# EasyEDA schematic BroadNode.json
TITLE: BroadNodeBase; REV: 1.0; Date: 2020-12-08; Sheet: 1/1; Drawn By: 36062A; Company: theBroadCorp.
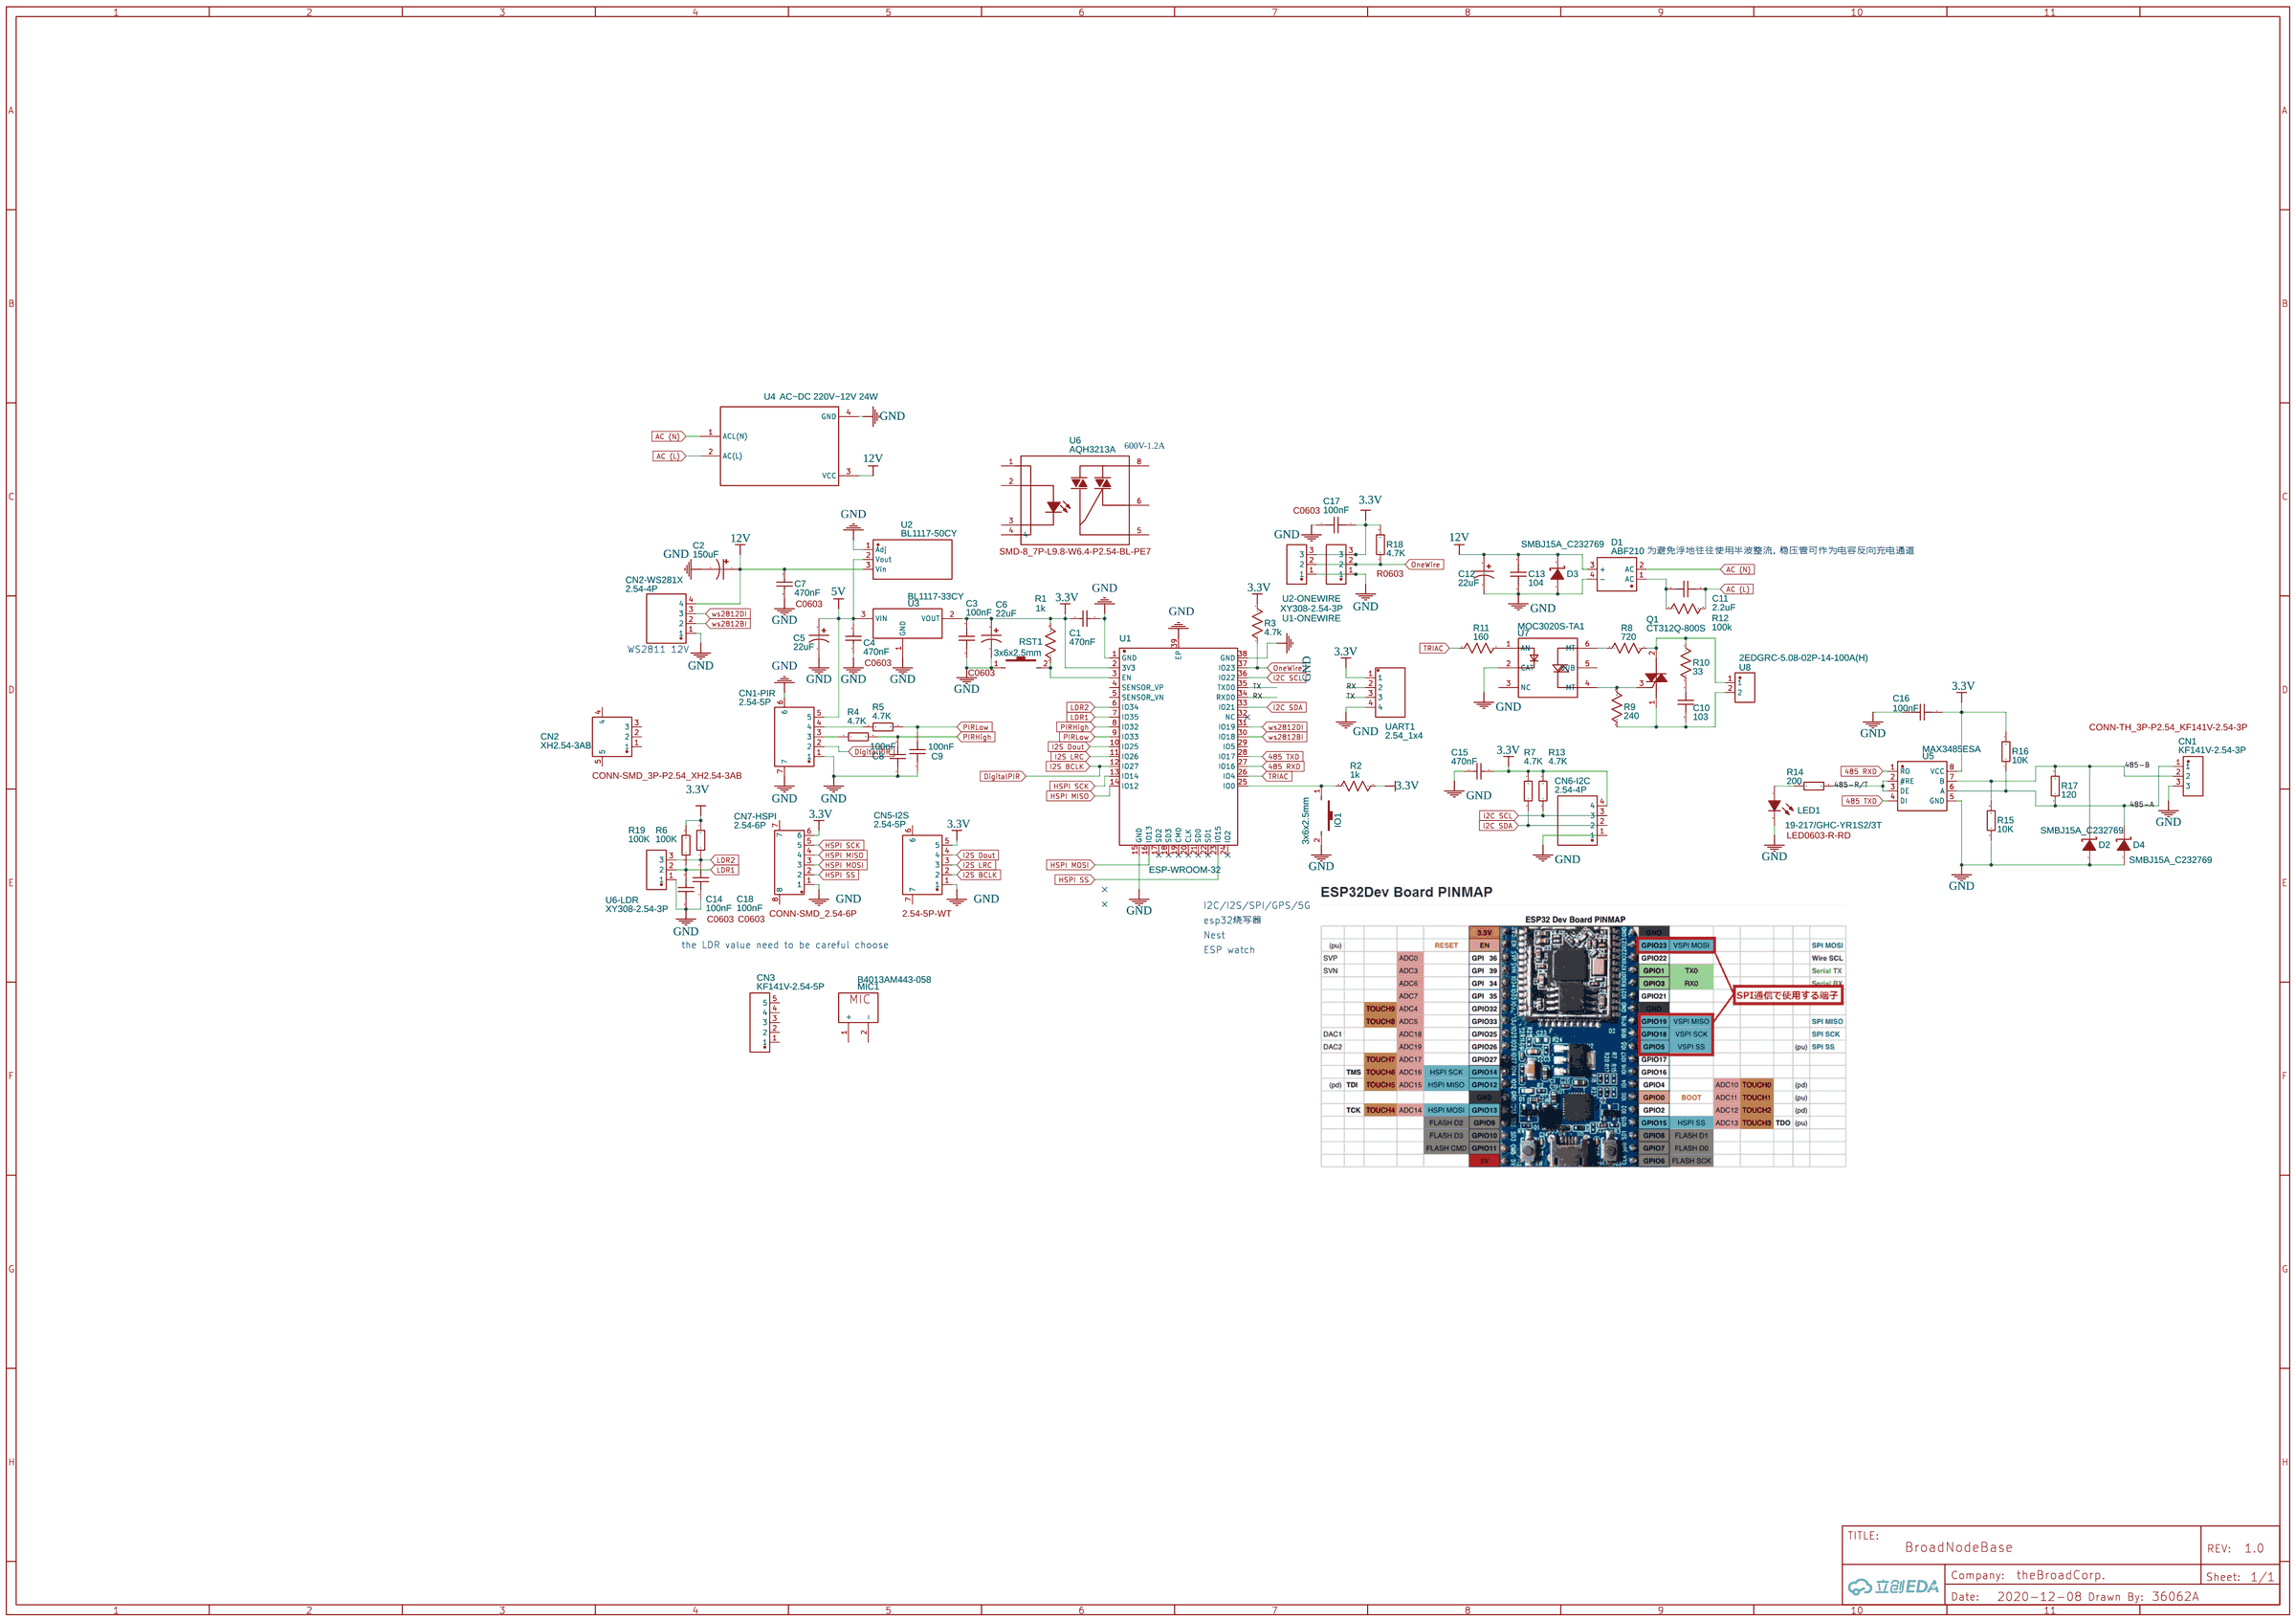
[diagram p0: schematic sheet]

## Parts
C1  470nF  [C0603]
C2  150uF  [CAP-SMD_BD8.0-L8.3-W8.3-RD]
C3  100nF  [C0603]
C4  470nF  [C0603]
C5  22uF  [CAP-SMD_BD6.3-L6.6-W6.6-FD]
C6  22uF  [CAP-SMD_BD6.3-L6.6-W6.6-FD]
C7  470nF  [C0603]
C8  100nF  [C0603]
C9  100nF  [C0603]
C10  103  [0603]
C11  2.2uF  [0603]
C12  22uF  [CAP-SMD_BD6.3-L6.6-W6.6-FD]
C13  104  [0603]
C14  100nF  [C0603]
C15  470nF  [C0603]
C16  100nF  [CAP_0603]
C17  100nF  [C0603]
C18  100nF  [C0603]
CN1  KF141V-2.54-3P  [CONN-TH_3P-P2.54_KF141V-2.54-3P]
CN1-PIR  2.54-5P  [2.54-5P-WT]
CN2  XH2.54-3AB  [CONN-SMD_3P-P2.54_XH2.54-3AB]
CN2-WS281X  2.54-4P  [CONN-SMD_2.54-4P-WT]
CN3  KF141V-2.54-5P  [CONN-TH_5P-P2.54_KF141V-2.54-5P]
CN5-I2S  2.54-5P  [2.54-5P-WT]
CN6-I2C  2.54-4P  [CONN-SMD_2.54-4P-WT]
CN7-HSPI  2.54-6P  [CONN-SMD_2.54-6P]
D1  ABF210  [ABS_L5.3-W4.6-P4.00-LS6.8-BL]
D2  SMBJ15A_C232769  [SMB(DO-214AA)]
D3  SMBJ15A_C232769  [SMB(DO-214AA)]
D4  SMBJ15A_C232769  [SMB(DO-214AA)]
IO1  3x6x2.5mm  [KEY-3.0*6.0]
LED1  19-217/GHC-YR1S2/3T  [LED0603-R-RD]
MIC1  B4013AM443-058  [MIC-SMD_BD4.0_B4013AM423-093]
Q1  CT312Q-800S  [TO-263-2_L10.1-W9.1-P5.08-LS15.2-BR]
R1  1k  [0603]
R2  1k  [0603]
R3  4.7k  [0603]
R4  4.7K  [R0603]
R5  4.7K  [R0603]
R6  100K  [R0603]
R7  4.7K  [R0603]
R8  720  [0603]
R9  240  [0603]
R10  33  [0603]
R11  160  [0603]
R12  100k  [0603]
R13  4.7K  [R0603]
R14  200  [RES_0603]
R15  10K  [RES_0603]
R16  10K  [RES_0603]
R17  120  [RES_0603]
R18  4.7K  [R0603]
R19  100K  [R0603]
RST1  3x6x2.5mm  [KEY-3.0*6.0]
U1  ESP-WROOM-32  [ESP-WROOM-32]
U1-ONEWIRE  XY308-2.54-3P  [CONN-TH_XY308-2.54-3P]
U2  BL1117-50CY  [TO-252-2_L6.6-W6.1-P4.57-LS9.9-BR-CW]
U2-ONEWIRE  XY308-2.54-3P  [CONN-TH_XY308-2.54-3P]
U3  BL1117-33CY  [TO-252-2_L6.6-W6.1-P4.57-LS9.9-TL-CW]
U4  AC~DC 220V~12V 24W  [AC&#126;DC 220V&#126;12V 24W TB563350789812]
U5  MAX3485ESA  [SOP-8_L5.0-W4.0-P1.27-LS6.0-BL]
U6  AQH3213A  [SMD-8_7P-L9.8-W6.4-P2.54-BL-PE7]
U6-LDR  XY308-2.54-3P  [CONN-TH_XY308-2.54-3P]
U7  MOC3020S-TA1  [SMD-6_L7.3-W6.5-P2.54-LS10.16-BL]
U8  2EDGRC-5.08-02P-14-100A(H)  [CONN-TH_2EDGRC-5.08-02P-14-100A(H)]
UART1  2.54_1x4  [DIP-1X4P-2.54MM-M]

## Library data of the parts
C1 C15 = CL10B474KA8NNNC: Supplier: LCSC; Manufacturer: SAMSUNG; Supplier Part: C1623; SMT Type: Basic; JLCPCB SMD: Yes; Package Display: No
C2 = OVZ151M1C0807-TRO: Supplier: LCSC; Supplier Part: C250092; Manufacturer: Lelon; Contributor: LCSC; SMT Type: Extend; JLCPCB SMD: Yes
C3 C14 C17 C18 = CC0603KRX7R9BB104: Supplier: LCSC; Manufacturer: YAGEO; Supplier Part: C14663; SMT Type: Basic; JLCPCB SMD: Yes; Package Display: Yes
C4 C7 = CL10B474KA8NNNC: Supplier: LCSC; Manufacturer: SAMSUNG; Supplier Part: C1623; SMT Type: Basic; JLCPCB SMD: Yes; Package Display: Yes
C5 C6 C12 = OCV220M1VTR-0606: Supplier: LCSC; Supplier Part: C473426; Manufacturer: Lelon; Contributor: LCSC
C8 C9 = CC0603KRX7R9BB104: Supplier: LCSC; Manufacturer: YAGEO; Supplier Part: C14663; SMT Type: Basic; JLCPCB SMD: Yes; Package Display: No
C10 C11 C13 = Cap_0603_US
C16 = CC0603KRX7R9BB104: Supplier: LCSC; Manufacturer: YAGEO; LCSC Assembly: Yes; Supplier Part: C14663; SMT Type: Basic
CN1 = KF141V-2.54-3P: Supplier: LCSC; Supplier Part: C475115; Manufacturer: Cixi Kefa Elec; Contributor: LCSC; Package Display: Yes
CN1-PIR = 2.54-5P: Supplier: LCSC; Supplier Part: C146121; Manufacturer: Boom Precision Elec; Contributor: LCSC
CN2 = XH2.54-3AB: Supplier: LCSC; Supplier Part: C146126; Manufacturer: Boom Precision Elec; Contributor: LCSC; Package Display: Yes
CN2-WS281X CN6-I2C = 2.54-4P: Supplier: LCSC; Supplier Part: C146120; Manufacturer: Boom Precision Elec; Contributor: LCSC
CN3 = KF141V-2.54-5P: Supplier: LCSC; Supplier Part: C475117; Manufacturer: Cixi Kefa Elec; Contributor: LCSC
CN5-I2S = 2.54-5P: Supplier: LCSC; Supplier Part: C146121; Manufacturer: Boom Precision Elec; Contributor: LCSC; Package Display: Yes
CN7-HSPI = 2.54-6P: Supplier: LCSC; Supplier Part: C146122; Manufacturer: Boom Precision Elec; Contributor: LCSC; Package Display: Yes
D1 = ABF210: Supplier: LCSC; Manufacturer: Jingdao; Contributor: LCSC; Supplier Part: C169534; SMT Type: Extend; JLCPCB SMD: Yes
D2-D4 = -: Supplier: LCSC; Supplier Part: C232769; Manufacturer: ON Semicon; Manufacturer Part: SMBJ15A; Contributor: LCSC
IO1 RST1 = -: Supplier Part: C5382; Supplier: LCSC; Manufacturer: ReliaPro
LED1 = 19-217/GHC-YR1S2/3T: Supplier: LCSC; Manufacturer: EVERLIGHT; image: //image.lceda.cn/szlcsc/C72043.jpg; Supplier Part: C72043; SMT Type: Basic; JLCPCB SMD: Yes; Package Display: Yes
MIC1 = B4013AM443-058: Supplier: LCSC; Supplier Part: C233795; Manufacturer: Goertek; Contributor: LCSC
Q1 = CT312Q-800S: Supplier: LCSC; Supplier Part: C527795; Manufacturer: CJ; Contributor: LCSC; SMT Type: Extend; JLCPCB SMD: Yes
R1-R3 R8-R12 = Res_0603(1/10W)_US
R4 R5 R7 R13 = 0603WAF4701T5E: Supplier: LCSC; Manufacturer: UniOhm; Supplier Part: C23162; SMT Type: Basic; JLCPCB SMD: Yes
R6 R19 = 0603WAF1003T5E: Supplier: LCSC; Manufacturer: UniOhm; Supplier Part: C25803; SMT Type: Basic; JLCPCB SMD: Yes
R14 = MCR03EZPJ201: Supplier: LCSC; Supplier Part: C253407; Manufacturer: ROHM Semicon; Contributor: LCSC
R15 R16 = RMCF0603JT10K0: Supplier: LCSC; Supplier Part: C238881; Manufacturer: Stackpole Elec; Contributor: LCSC
R17 = MCR03EZPFX1200: Supplier: LCSC; Supplier Part: C253379; Manufacturer: ROHM Semicon; Contributor: LCSC
R18 = 0603WAF4701T5E: Supplier: LCSC; Manufacturer: UniOhm; Supplier Part: C23162; SMT Type: Basic; JLCPCB SMD: Yes; Package Display: Yes
U1 = -: Supplier: LCSC; Manufacturer: ESPRESSIF; Supplier Part: C95209
U1-ONEWIRE U2-ONEWIRE U6-LDR = XY308-2.54-3P: Supplier: LCSC; Supplier Part: C557686; Manufacturer: --; Contributor: LCSC
U2 = BL1117-50CY: Supplier: LCSC; Supplier Part: C194636; Manufacturer: Shanghai Belling; Contributor: LCSC
U3 = BL1117-33CY: Supplier: LCSC; Manufacturer: BL; Contributor: LCSC; Supplier Part: C165080; SMT Type: Extend; JLCPCB SMD: Yes
U4 = AC&#126;DC 220V&#126;12V 24W: Manufacturer Part: New SchematicLib; Contributor: Kisro
U5 = MAX3485ESA: Supplier: LCSC; Supplier Part: C668204; Manufacturer: UMW(Youtai Semiconductor Co., Ltd.); Contributor: LCSC
U6 = AQH3213A: Supplier: LCSC; Manufacturer: PANASONIC; Contributor: LCSC; Supplier Part: C91557; Package Display: Yes
U7 = MOC3020S-TA1: Supplier: LCSC; Manufacturer: LITEON; Contributor: LCSC; Supplier Part: C115464; SMT Type: Extend; JLCPCB SMD: Yes
U8 = 2EDGRC-5.08-02P-14-100A(H): Supplier: LCSC; Supplier Part: C669314; Manufacturer: DEGSON; Contributor: LCSC
UART1 = -: Supplier: LCSC; Manufacturer: Ckmtw; Manufacturer Part: 210S-1*4P L=11.6MMGold-plated black; Contributor: LCSC; Supplier Part: C124378

## Nets
3.3V: C1.2 C3.2 C6.1 C15.1 C16.1 C17.1 CN5-I2S.5 CN6-I2C.4 CN7-HSPI.6 R1.2 R2.2 R3.2 R6.2 R7.2 R13.2 R16.2 R18.2 R19.2 U1.2(3V3) U1-ONEWIRE.3 U2-ONEWIRE.3 U3.2(VOUT) U5.8(VCC) UART1.1
5V: C4.2 C5.1 CN1-PIR.5 U2.2(Vout) U3.3(VIN)
12V: C2.1 C7.2 C12.1 C13.1 CN2-WS281X.4 D1.3(+) D3.2(K) U2.3(Vin) U4.3(VCC)
GND: C1.1 C2.2 C3.1 C4.1 C5.2 C6.2 C7.1 C8.1 C9.1 C12.2 C13.2 C14.1 C15.2 C16.2 C17.2 C18.1 CN1.3 CN1-PIR.1 CN1-PIR.6 CN1-PIR.7 CN2-WS281X.1 CN5-I2S.1 CN6-I2C.1 CN7-HSPI.1 D1.4(-) D2.1(A) D3.1(A) D4.1(A) IO1.2 LED1.2(C) R15.1 RST1.1 U1.1(GND) U1.15(GND) U1.38(GND) U1.39(EP) U1-ONEWIRE.1 U2.1(Adj) U2-ONEWIRE.1 U3.1(GND) U4.4(GND) U5.5(GND) U6-LDR.1 U7.2(CAT) UART1.4
485 RXD: U1.27(IO16) U5.1(RO)
485 TXD: U1.28(IO17) U5.4(DI)
485-A: CN1.1 D4.2(K) R16.1 R17.1 U5.6(A)
485-B: CN1.2 D2.2(K) R15.2 R17.2 U5.7(B)
485-R/T: R14.2 U5.2(#RE) U5.3(DE)
AC (L): C11.2 R12.2 U4.2(AC(L))
AC (N): D1.2(AC) U4.1(ACL(N))
DigitalPIR: CN1-PIR.2 CN5-I2S.2 U1.12(IO27)
HSPI MISO: CN7-HSPI.4 U1.14(IO12)
HSPI MOSI: CN7-HSPI.3 U1.16(IO13)
HSPI SCK: CN7-HSPI.5 U1.13(IO14)
HSPI SS: CN7-HSPI.2 U1.23(IO15)
I2C SCL: CN6-I2C.3 R13.1 U1.36(IO22)
I2C SDA: CN6-I2C.2 R7.1 U1.33(IO21)
I2S Dout: CN5-I2S.4 U1.10(IO25)
I2S LRC: CN5-I2S.3 U1.11(IO26)
LDR1: C14.2 R19.1 U1.7(IO35) U6-LDR.2
LDR2: C18.2 R6.1 U1.6(IO34) U6-LDR.3
OneWire: R3.1 R18.1 U1.37(IO23) U1-ONEWIRE.2 U2-ONEWIRE.2
PIRHigh: C8.2 R4.2 U1.8(IO32)
PIRLow: C9.2 R5.2 U1.9(IO33)
RX: U1.34(RXD0) UART1.2
TRIAC: R11.2 U1.26(IO4)
TX: U1.35(TXD0) UART1.3
ws2812BI: CN2-WS281X.2 U1.30(IO18)
ws2812DI: CN2-WS281X.3 U1.31(IO19)
Net-(C10-1): C10.1 R10.2
Net-(C10-2): C10.2 Q1.1(T1) R9.1 U8.2
Net-(C11-1): C11.1 D1.1(AC) R12.1
Net-(CN1-PIR-3): CN1-PIR.3 R4.1
Net-(CN1-PIR-4): CN1-PIR.4 R5.1
Net-(IO1-1): IO1.1 R2.1 U1.25(IO0)
Net-(LED1-1): LED1.1(A) R14.1
Net-(Q1-2): Q1.2(T2) R8.1 R10.1 U8.1
Net-(Q1-3): Q1.3(G) R9.2 U7.4(MT)
Net-(R1-1): R1.1 RST1.2 U1.3(EN)
Net-(R8-2): R8.2 U7.6(MT)
Net-(R11-1): R11.1 U7.1(AN)

Not connected (* = marked no-connect by the designer): CN2 1 2 3 4 5; CN3 1 2 3 4 5; CN5-I2S 6 7; CN7-HSPI 7 8; MIC1 1(+) 2(-); U1 4(SENSOR_VP) 5(SENSOR_VN) 17(SD2)* 18(SD3)* 19(CMD)* 20(CLK)* 21(SD0)* 22(SD1)* 24(IO2)* 29(IO5) 32(NC)*; U6 1 2 3 4 5 6 8; U7 3(NC) 5(SUB)

## Notes on the sheet
- 600V-1.2A
- 为避免浮地往往使用半波整流，稳压管可作为电容反向充电通道
- WS2811 12V
- I2C/I2S/SPI/GPS/5G
- esp32烧写器
- Nest
- the LDR value need to be careful choose
- ESP watch
